# Altium schematic sheet SchemaBloc.SchDoc
size A3; Date: 26.01.2022; Author: Ali Zoubir; CompanyName: ETML-ES; DrawnBy: Ali Zoubir; Engineer: Ali Zoubir; Organization: ETML-ES; Address1: Avenue Recordon 1; Address2: 1004 Lausanne; Address3: Switzerland; Revision: 1924B; SheetNumber: 1; SheetTotal: 4; Version: V0
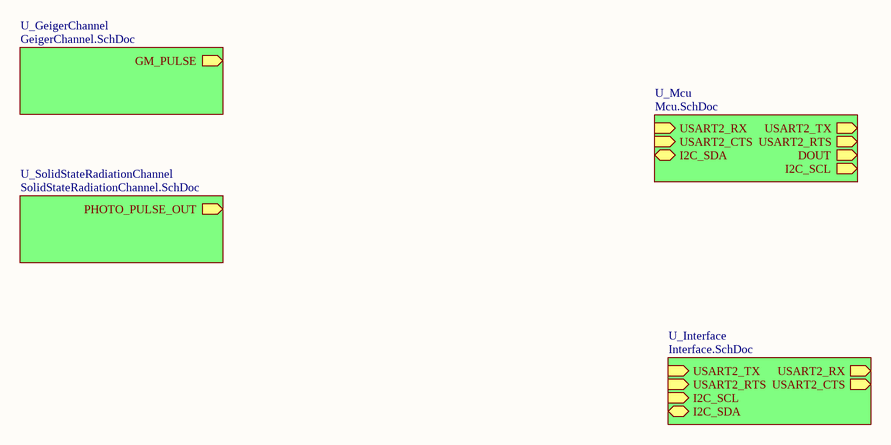
[diagram p0: SchemaBloc.SchDoc]

## Sub-sheets
U_GeigerChannel = GeigerChannel.SchDoc: GM_PULSE (out)
U_Interface = Interface.SchDoc: USART2_TX (in), USART2_RX (out), USART2_RTS (in), USART2_CTS (out), I2C_SCL (in), I2C_SDA (bidir)
U_Mcu = Mcu.SchDoc: USART2_TX (out), USART2_RX (in), USART2_RTS (out), USART2_CTS (in), DOUT (out), I2C_SCL (out), I2C_SDA (bidir)
U_SolidStateRadiationChannel = SolidStateRadiationChannel.SchDoc: PHOTO_PULSE_OUT (out)

## Notes on the sheet
- Fichier :
- a
- Date :
- Heure :
- Version :
- Auteur :
- Modif.
- b
- c
- d
- Projet :
- No :
- Nb feuilles
- Feuille n°
- Chemin :